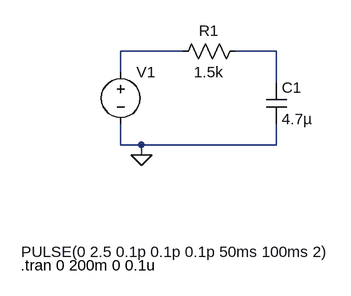
[diagram p0: schematic pulseRC_circuit.asc]
pulseRC_circuit.asc, the LTspice schematic file:
Version 4
SHEET 1 880 680
WIRE 128 64 32 64
WIRE 272 64 208 64
WIRE 32 96 32 64
WIRE 272 112 272 64
WIRE 32 208 32 176
WIRE 64 208 32 208
WIRE 272 208 272 176
WIRE 272 208 64 208
WIRE 64 224 64 208
FLAG 64 224 0
SYMBOL voltage 32 80 R0
WINDOW 3 -153 293 Left 2
WINDOW 123 0 0 Left 0
WINDOW 39 0 0 Left 0
SYMATTR InstName V1
SYMATTR Value PULSE(0 2.5 0.1p 0.1p 0.1p 50ms 100ms 2)
SYMBOL res 224 48 R90
WINDOW 0 0 56 VBottom 2
WINDOW 3 32 56 VTop 2
SYMATTR InstName R1
SYMATTR Value 1.5k
SYMBOL cap 256 112 R0
SYMATTR InstName C1
SYMATTR Value 4.7µ
TEXT -122 394 Left 2 !.tran 0 200m 0 0.1u

The netlist it stands for:
* pulseRC_circuit.asc
V1 N001 0 PULSE(0 2.5 0.1p 0.1p 0.1p 50ms 100ms 2)
R1 N002 N001 1.5k
C1 N002 0 4.7µ
.tran 0 200m 0 0.1u
.backanno
.end